# EAGLE schematic drola_base_node (EAGLE 8.3.1)
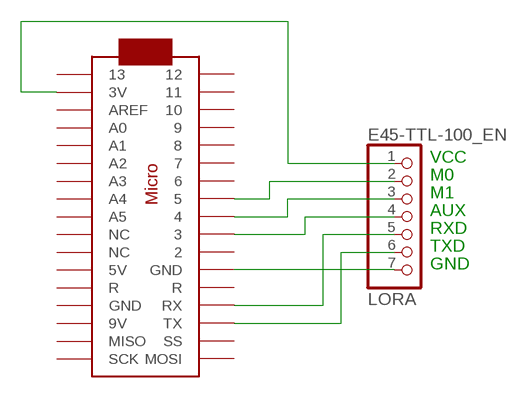
[diagram p0: schematic, sheet 1]

## Parts
ARDUINO_MICRO  ARDUINO_MICRO  ARDUINOMICRO  [ARDUINOMICRO]
E45-TTL-100_EN  LORA  PINHD-1X7/90  [1X07/90]

## Nets
N$1: ARDUINO_MICRO.P$33(3V) E45-TTL-100_EN.1
N$2: ARDUINO_MICRO.P$8 E45-TTL-100_EN.2
N$3: ARDUINO_MICRO.P$9 E45-TTL-100_EN.3
N$4: ARDUINO_MICRO.P$10 E45-TTL-100_EN.4
N$5: ARDUINO_MICRO.P$14(RX) E45-TTL-100_EN.5
N$6: ARDUINO_MICRO.P$15(TX) E45-TTL-100_EN.6
N$7: ARDUINO_MICRO.P$21(GND) E45-TTL-100_EN.7
Unconnected: ARDUINO_MICRO.P$1 ARDUINO_MICRO.P$2 ARDUINO_MICRO.P$3 ARDUINO_MICRO.P$4 ARDUINO_MICRO.P$5 ARDUINO_MICRO.P$6 ARDUINO_MICRO.P$7 ARDUINO_MICRO.P$11 ARDUINO_MICRO.P$12(GND) ARDUINO_MICRO.P$13(R) ARDUINO_MICRO.P$16(SS) ARDUINO_MICRO.P$17(MOSI) ARDUINO_MICRO.P$18(SCK) ARDUINO_MICRO.P$19(MISO) ARDUINO_MICRO.P$20(9V) ARDUINO_MICRO.P$22(R) ARDUINO_MICRO.P$23(5V) ARDUINO_MICRO.P$24(NC) ARDUINO_MICRO.P$25(NC) ARDUINO_MICRO.P$26(A5) ARDUINO_MICRO.P$27(A4) ARDUINO_MICRO.P$28(A3) ARDUINO_MICRO.P$29(A2) ARDUINO_MICRO.P$30(A1) ARDUINO_MICRO.P$31(A0) ARDUINO_MICRO.P$32(AREF) ARDUINO_MICRO.P$34

## Notes on the sheet
- VCC
- M0
- M1
- AUX
- RXD
- TXD
- GND

## Library data of the parts
ARDUINO_MICRO = adafruit:ARDUINOMICRO
E45-TTL-100_EN = pinhead:PINHD-1X7: PIN HEADER